# EAGLE schematic uru-card-dev-board (EAGLE 9.6.2)
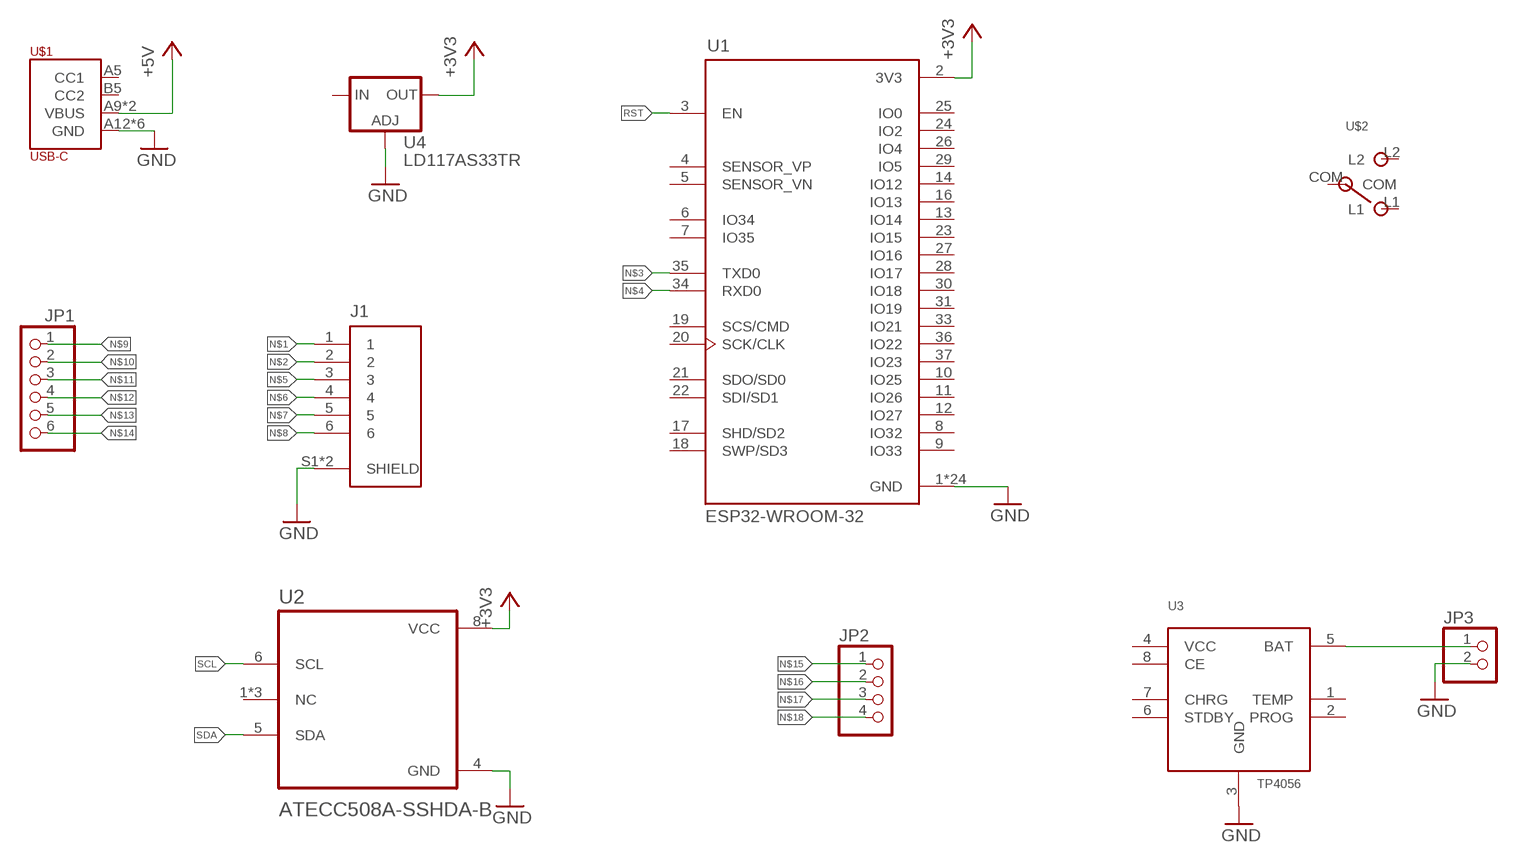
[diagram p0: schematic, sheet 1]

## Parts
J1  SM06B-GHS-TB(LF)(SN)  [JST_SM06B-GHS-TB(LF)(SN)]
JP1  PINHD-1X6/90  [1X06/90]
JP2  PINHD-1X4  [1X04]
JP3  PINHD-1X2  [1X02]
U1  ESP32-WROOM-32  [MODULE_ESP32-WROOM-32]
U2  ATECC508A-SSHDA-B  [SOIC127P600X175-8N]
U3  TP4056  [SOP-8]
U4  LD117AS33TR  [SOT223]
U$1  USB-C  [USB-C]
U$2  MSK-12C02_SMD_SPDT_SWITCH  [MSK-12C02]

## Nets
+3V3: U1.2(3V3) U2.8(VCC) U4.4(OUT)
+5V: U$1.A9(VBUS) U$1.B9(VBUS)
GND: J1.S1(SHIELD) J1.S2(SHIELD) JP3.2 U1.1(GND) U1.15(GND) U1.38(GND) U1.39_1(GND) U1.39_2(GND) U1.39_3(GND) U1.39_4(GND) U1.39_5(GND) U1.39_6(GND) U1.39_7(GND) U1.39_8(GND) U1.39_9(GND) U1.39_10(GND) U1.39_11(GND) U1.39_12(GND) U1.39_13(GND) U1.39_14(GND) U1.39_15(GND) U1.39_16(GND) U1.39_17(GND) U1.39_18(GND) U1.39_19(GND) U1.39_20(GND) U1.39_21(GND) U2.4(GND) U3.3(GND) U4.1(ADJ) U$1.A12(GND) U$1.B12(GND) U$1.P$7(GND) U$1.P$8(GND) U$1.P$9(GND) U$1.P$10(GND)
N$1: J1.1
N$2: J1.2
N$3: U1.35(TXD0)
N$4: U1.34(RXD0)
N$5: J1.3
N$6: J1.4
N$7: J1.5
N$8: J1.6
N$9: JP1.1
N$10: JP1.2
N$11: JP1.3
N$12: JP1.4
N$13: JP1.5
N$14: JP1.6
N$15: JP2.1
N$16: JP2.2
N$17: JP2.3
N$18: JP2.4
N$20: JP3.1 U3.5(BAT)
RST: U1.3(EN)
SCL: U2.6(SCL)
SDA: U2.5(SDA)
Unconnected: U1.4(SENSOR_VP) U1.5(SENSOR_VN) U1.6(IO34) U1.7(IO35) U1.8(IO32) U1.9(IO33) U1.10(IO25) U1.11(IO26) U1.12(IO27) U1.13(IO14) U1.14(IO12) U1.16(IO13) U1.17(SHD/SD2) U1.18(SWP/SD3) U1.19(SCS/CMD) U1.20(SCK/CLK) U1.21(SDO/SD0) U1.22(SDI/SD1) U1.23(IO15) U1.24(IO2) U1.25(IO0) U1.26(IO4) U1.27(IO16) U1.28(IO17) U1.29(IO5) U1.30(IO18) U1.31(IO19) U1.33(IO21) U1.36(IO22) U1.37(IO23) U2.1(NC) U2.2(NC) U2.3(NC) U3.1(TEMP) U3.2(PROG) U3.4(VCC) U3.6(STDBY) U3.7(CHRG) U3.8(CE) U4.3(IN) U$1.A5(CC1) U$1.B5(CC2) U$2.COM U$2.L1 U$2.L2

## Library data of the parts
J1 = SM06B-GHS-TB_LF__SN_:SM06B-GHS-TB(LF)(SN): GHS Series 1.25 mm Pitch Disc. Crimp Wire-to-Wire Connector Check prices <https://pricing.snapeda.com/parts/SM06B-GHS-TB%28LF%29%28SN%29/JST%20Sales/view-part?ref=eda>; AVAILABILITY: Warning; DESCRIPTION: Connector Header Surface Mount, Right Angle 6 position 0.049 (1.25mm); MF: JST Sales; MP: SM06B-GHS-TB(LF)(SN); PACKAGE: None; PRICE: None; PURCHASE-URL: https://pricing.snapeda.com/search/part/SM06B-GHS-TB(LF)(SN)/?ref=eda
JP1 = pinhead:PINHD-1X6: PIN HEADER
JP2 = pinhead:PINHD-1X4: PIN HEADER
JP3 = pinhead:PINHD-1X2: PIN HEADER
U1 = ESP32-WROOM-32:ESP32-WROOM-32: Bluetooth, WiFi Transceiver Module 2.4GHz ~ 2.5GHz Surface Mount; AVAILABILITY: Unavailable; DESCRIPTION: Bluetooth, WiFi 802.11b/g/n, Bluetooth v4.2 +EDR, Class 1, 2 and 3 Transceiver Module 2.4GHz ~ 2.5GHz Integrated, Trace Surface Mount; MF: Espressif Systems; MP: ESP32-WROOM-32; PACKAGE: Module Espressif Systems; PRICE: None
U2 = ATECC508A-SSHDA-B:ATECC508A-SSHDA-B: None Check prices <https://pricing.snapeda.com/parts/ATECC508A-SSHDA-B/Microchip/view-part?ref=eda>; AVAILABILITY: Good; DESCRIPTION: IC AUTHENTICATION CHIP 8SOIC; MF: Microchip; MP: ATECC508A-SSHDA-B; PACKAGE: SOIC-8 Microchip; PRICE: None; PURCHASE-URL: https://pricing.snapeda.com/search/part/ATECC508A-SSHDA-B/?ref=eda
U3 = TP4056:TP4056; AVAILABILITY: Unavailable; DESCRIPTION: Complete single cell Li-Ion battery with a constant current / constant voltage linear charger; MF: NanJing Top Power ASIC Corp.; MP: TP4056; PACKAGE: Package; PRICE: None
U4 = v-reg:LD117A?*: Low drop fixed and adjustable positive voltage regulators 1 A Source: http://www.st.com/stonline/products/literature/ds/7194/ld1117axx.pdf
U$1 = USB-C:USB-C
U$2 = MSK-12C02 SMD Micro Slider Switch SPDT:MSK-12C02_SMD_SPDT_SWITCH: Footprint of the VIMEX MSK-12C02 SPDT SMD Switch Created by mzst on 17-Jan-2016